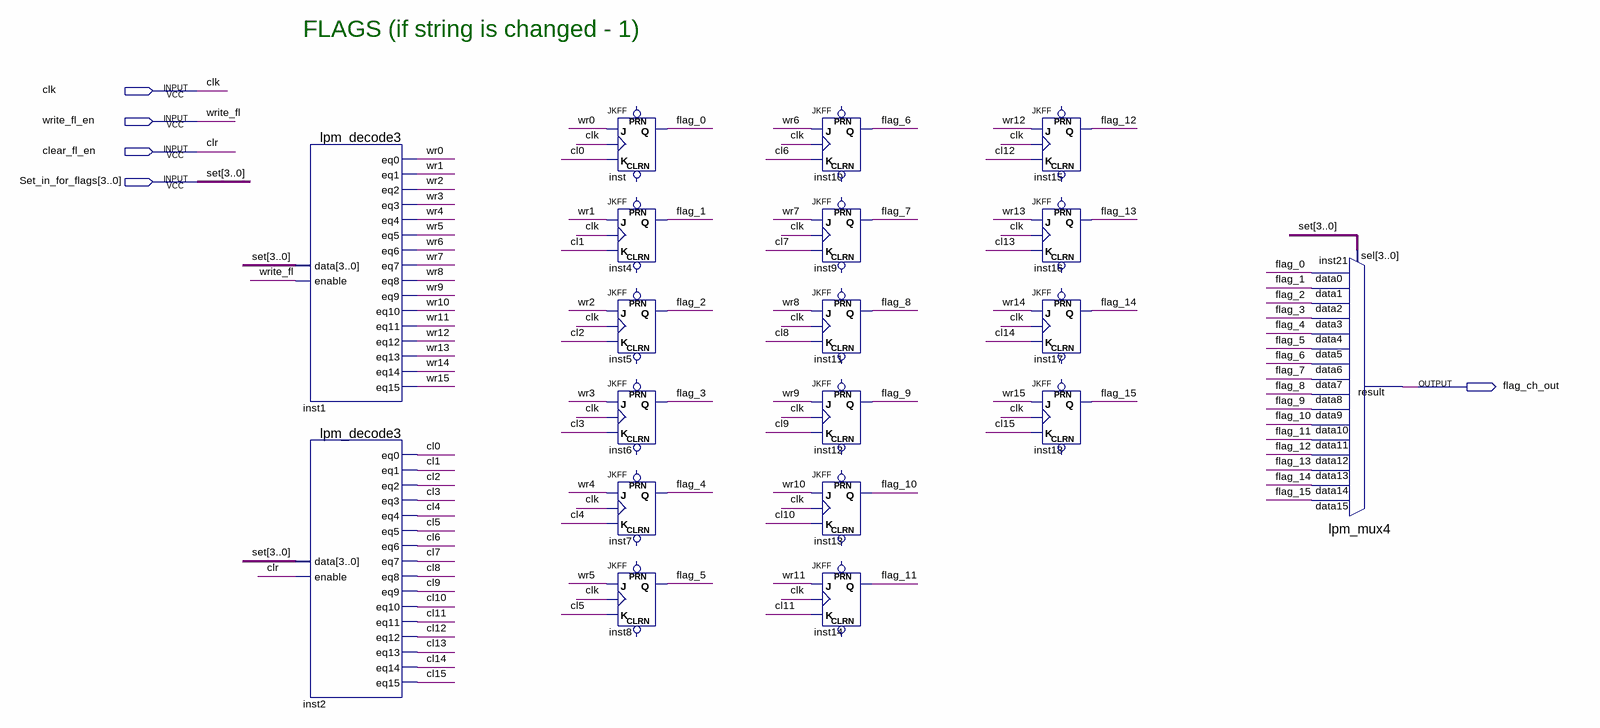
[diagram p0: schematic sheet]
// Quartus schematic Changing_Flags.bdf as structural Verilog: 19 symbols, 5 pins
module Changing_Flags (
  input  clk,
  input  write_fl_en,
  input  clear_fl_en,
  input  [3:0] Set_in_for_flags,
  output flag_ch_out
);

  wire cl0, cl1, cl2, cl3, cl4, cl5, cl6, cl7, cl8, cl9, cl10, cl11, cl12, cl13, cl14, cl15, flag_0, flag_1,
       flag_2, flag_3, flag_4, flag_5, flag_6, flag_7, flag_8, flag_9, flag_10, flag_11, flag_12, flag_13,
       flag_14, flag_15, wr0, wr1, wr2, wr3, wr4, wr5, wr6, wr7, wr8, wr9, wr10, wr11, wr12, wr13, wr14, wr15;

  lpm_decode3 inst1 (
    .data(Set_in_for_flags), .enable(write_fl_en), .eq0(wr0), .eq1(wr1), .eq2(wr2), .eq3(wr3), .eq4(wr4),
    .eq5(wr5), .eq6(wr6), .eq7(wr7), .eq8(wr8), .eq9(wr9), .eq10(wr10), .eq11(wr11), .eq12(wr12),
    .eq13(wr13), .eq14(wr14), .eq15(wr15));
  lpm_decode3 inst2 (
    .data(Set_in_for_flags), .enable(clear_fl_en), .eq0(cl0), .eq1(cl1), .eq2(cl2), .eq3(cl3), .eq4(cl4),
    .eq5(cl5), .eq6(cl6), .eq7(cl7), .eq8(cl8), .eq9(cl9), .eq10(cl10), .eq11(cl11), .eq12(cl12),
    .eq13(cl13), .eq14(cl14), .eq15(cl15));
  JKFF inst (.K(cl0), .J(wr0), .CLK(clk), .Q(flag_0));  // open: PRN, CLRN
  JKFF inst4 (.K(cl1), .J(wr1), .CLK(clk), .Q(flag_1));  // open: PRN, CLRN
  JKFF inst5 (.K(cl2), .J(wr2), .CLK(clk), .Q(flag_2));  // open: PRN, CLRN
  JKFF inst6 (.K(cl3), .J(wr3), .CLK(clk), .Q(flag_3));  // open: PRN, CLRN
  JKFF inst7 (.K(cl4), .J(wr4), .CLK(clk), .Q(flag_4));  // open: PRN, CLRN
  JKFF inst8 (.K(cl5), .J(wr5), .CLK(clk), .Q(flag_5));  // open: PRN, CLRN
  JKFF inst10 (.K(cl6), .J(wr6), .CLK(clk), .Q(flag_6));  // open: PRN, CLRN
  JKFF inst9 (.K(cl7), .J(wr7), .CLK(clk), .Q(flag_7));  // open: PRN, CLRN
  JKFF inst11 (.K(cl8), .J(wr8), .CLK(clk), .Q(flag_8));  // open: PRN, CLRN
  JKFF inst12 (.K(cl9), .J(wr9), .CLK(clk), .Q(flag_9));  // open: PRN, CLRN
  JKFF inst13 (.K(cl10), .J(wr10), .CLK(clk), .Q(flag_10));  // open: PRN, CLRN
  JKFF inst14 (.K(cl11), .J(wr11), .CLK(clk), .Q(flag_11));  // open: PRN, CLRN
  JKFF inst15 (.K(cl12), .J(wr12), .CLK(clk), .Q(flag_12));  // open: PRN, CLRN
  JKFF inst16 (.K(cl13), .J(wr13), .CLK(clk), .Q(flag_13));  // open: PRN, CLRN
  JKFF inst17 (.K(cl14), .J(wr14), .CLK(clk), .Q(flag_14));  // open: PRN, CLRN
  JKFF inst18 (.K(cl15), .J(wr15), .CLK(clk), .Q(flag_15));  // open: PRN, CLRN
  lpm_mux4 inst21 (
    .data15(flag_15), .data14(flag_14), .data13(flag_13), .data12(flag_12), .data11(flag_11),
    .data10(flag_10), .data9(flag_9), .data8(flag_8), .data7(flag_7), .data6(flag_6), .data5(flag_5),
    .data4(flag_4), .data3(flag_3), .data2(flag_2), .data1(flag_1), .data0(flag_0), .sel(Set_in_for_flags),
    .result(flag_ch_out));

  // Other names for the same wires on the sheet: clr = clear_fl_en; set[3:0] = Set_in_for_flags;
  //   write_fl = write_fl_en

  // Notes on the sheet:
  //   FLAGS (if string is changed - 1)
endmodule
